# EAGLE schematic Busbar interface (EAGLE 5.12)
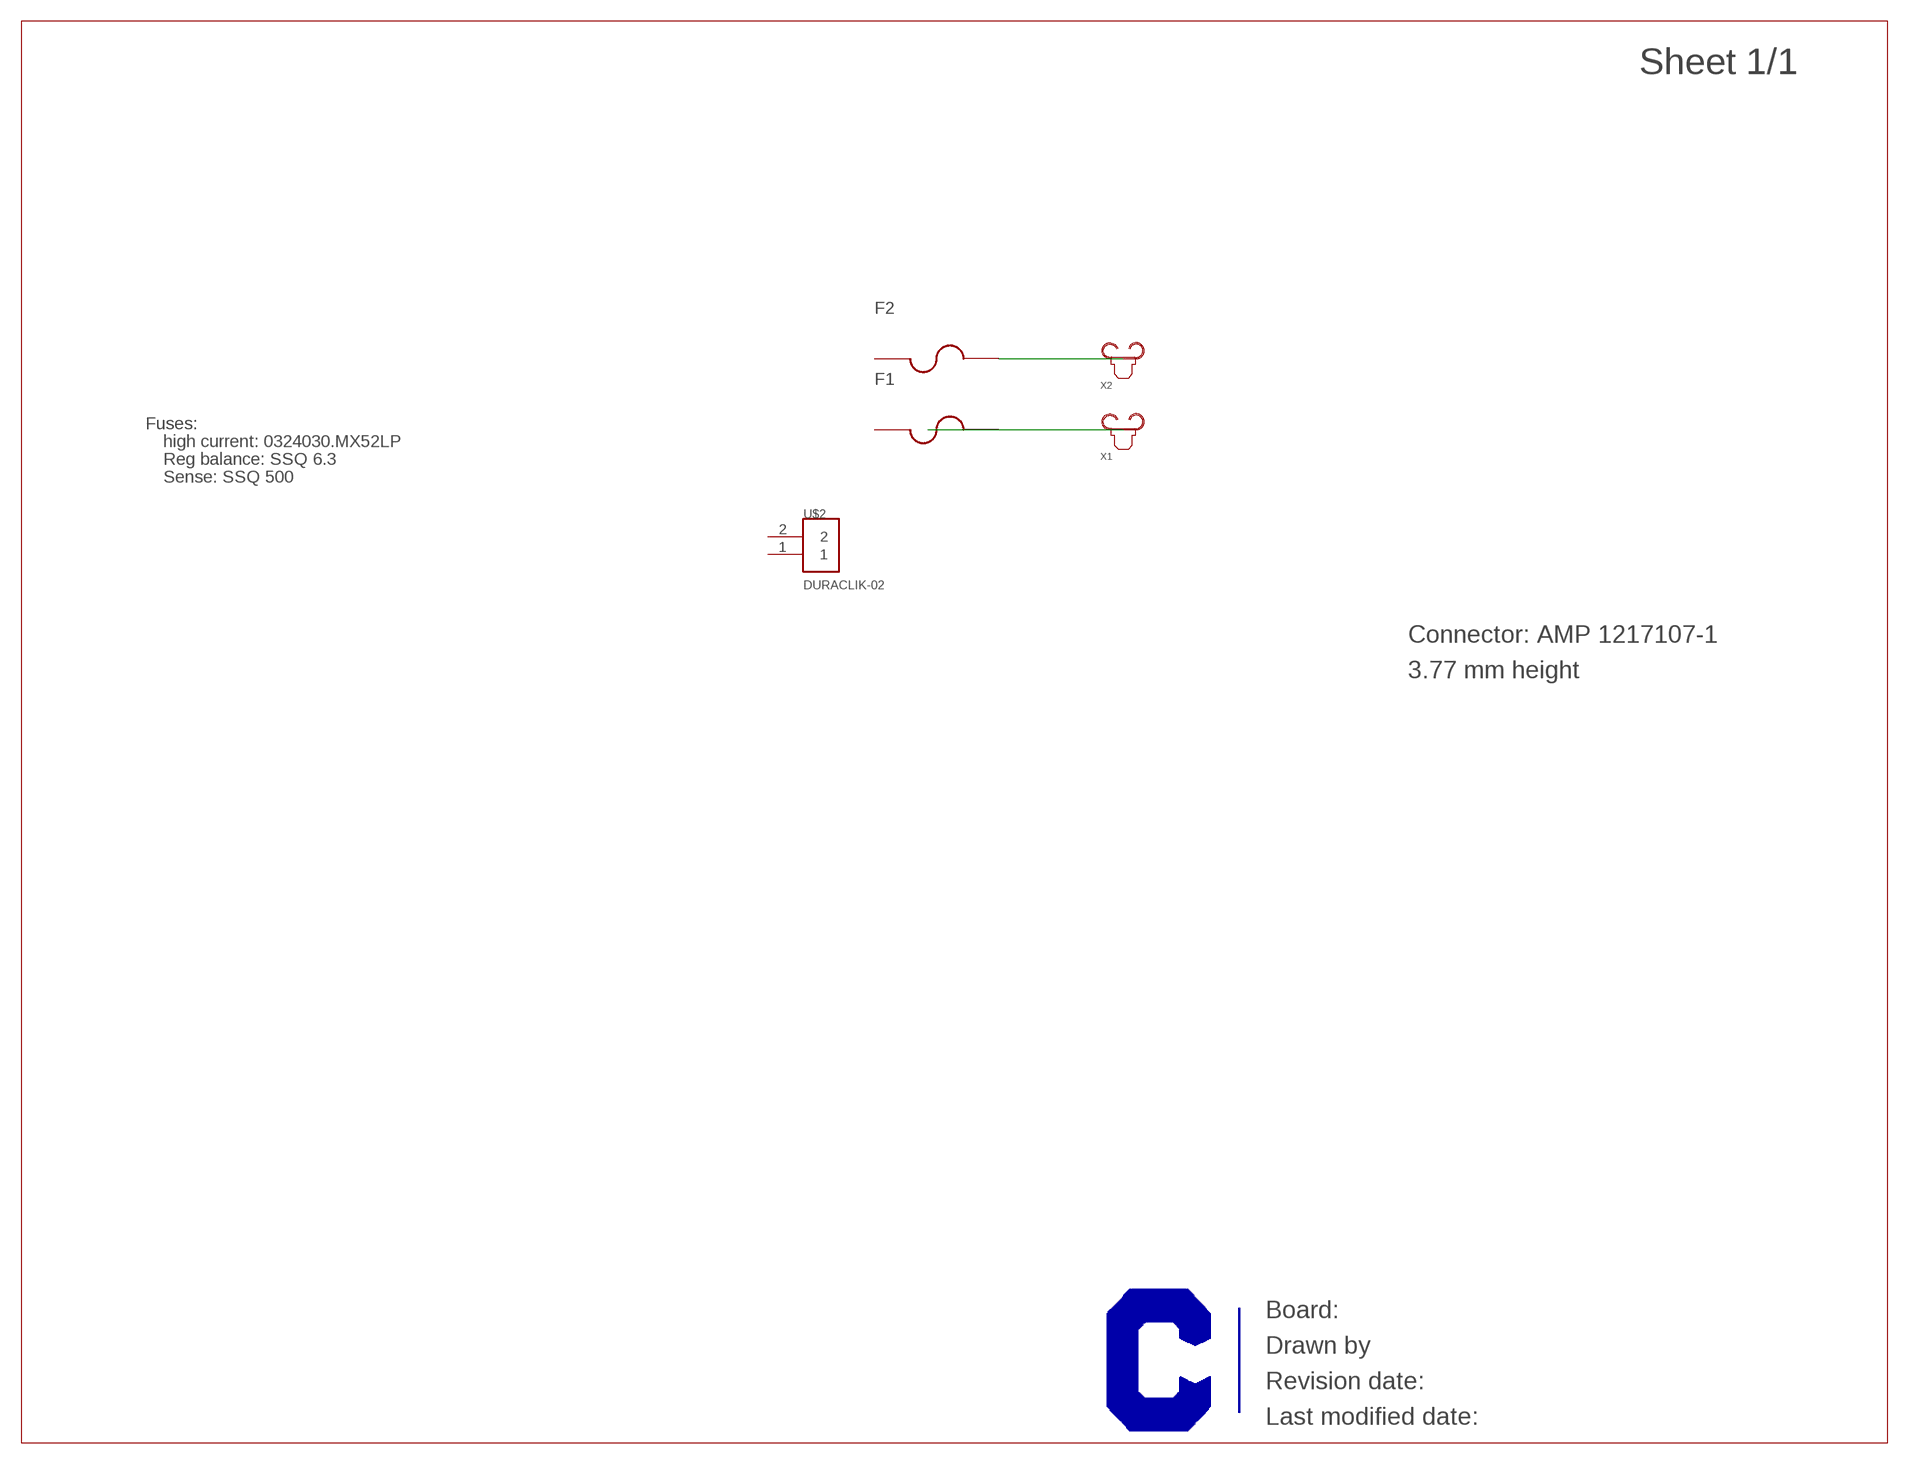
[diagram p0: schematic, sheet 1]

## Parts
F1  SSQ  [SSQ]
F2  SSQ  [SSQ]
U$1  CURRENT-C-LETTER-LANDSCAPE  [BLANK]
U$2  DURACLIK-02  [DURACLIK-02]
X1  FASTON_FEMALE_BLADE_CONN-HORIZ-PCB  [FASTON_1217107-1]
X2  FASTON_FEMALE_BLADE_CONN-HORIZ-PCB  [FASTON_1217107-1]

## Nets
N$1: X1.1
N$2: F2.2 X2.1
Unconnected: F1.1 F1.2 F2.1 U$2.1 U$2.2

## Notes on the sheet
- Fuses:
- high current: 0324030.MX52LP
- Reg balance: SSQ 6.3
- Sense: SSQ 500
- Connector: AMP 1217107-1
- 3.77 mm height

## Library data of the parts
F1 F2 = Bel-Fuse:SSQ: SSQ series - Square Ceramic Surface Mount Quick-Acting Fuse Datasheet: http://belfuse.com/pdfs/SSQ.pdf
U$1 = Frames:CURRENT-C-LETTER-LANDSCAPE; BOM: EXCLUDE
U$2 = BMC components:DURACLIK-02: MOLEX DuraClik Wire-to-Board Header, Single Row, Right Angle, 2 Circuits Drawing: 5023520600_sd.pdf <http://www.molex.com/pdm_docs/sd/5023520600_sd.pdf> Information: 502352-0200 <http://www.molex.com/molex/products/datasheet.jsp?part=active/5023520200_PCB_HEADERS.xml>
X1 X2 = TE-Aaron:FASTON_FEMALE_BLADE_CONN: TE Faston - female PCB-mount blade terminal; PARTNO: 1217107-1